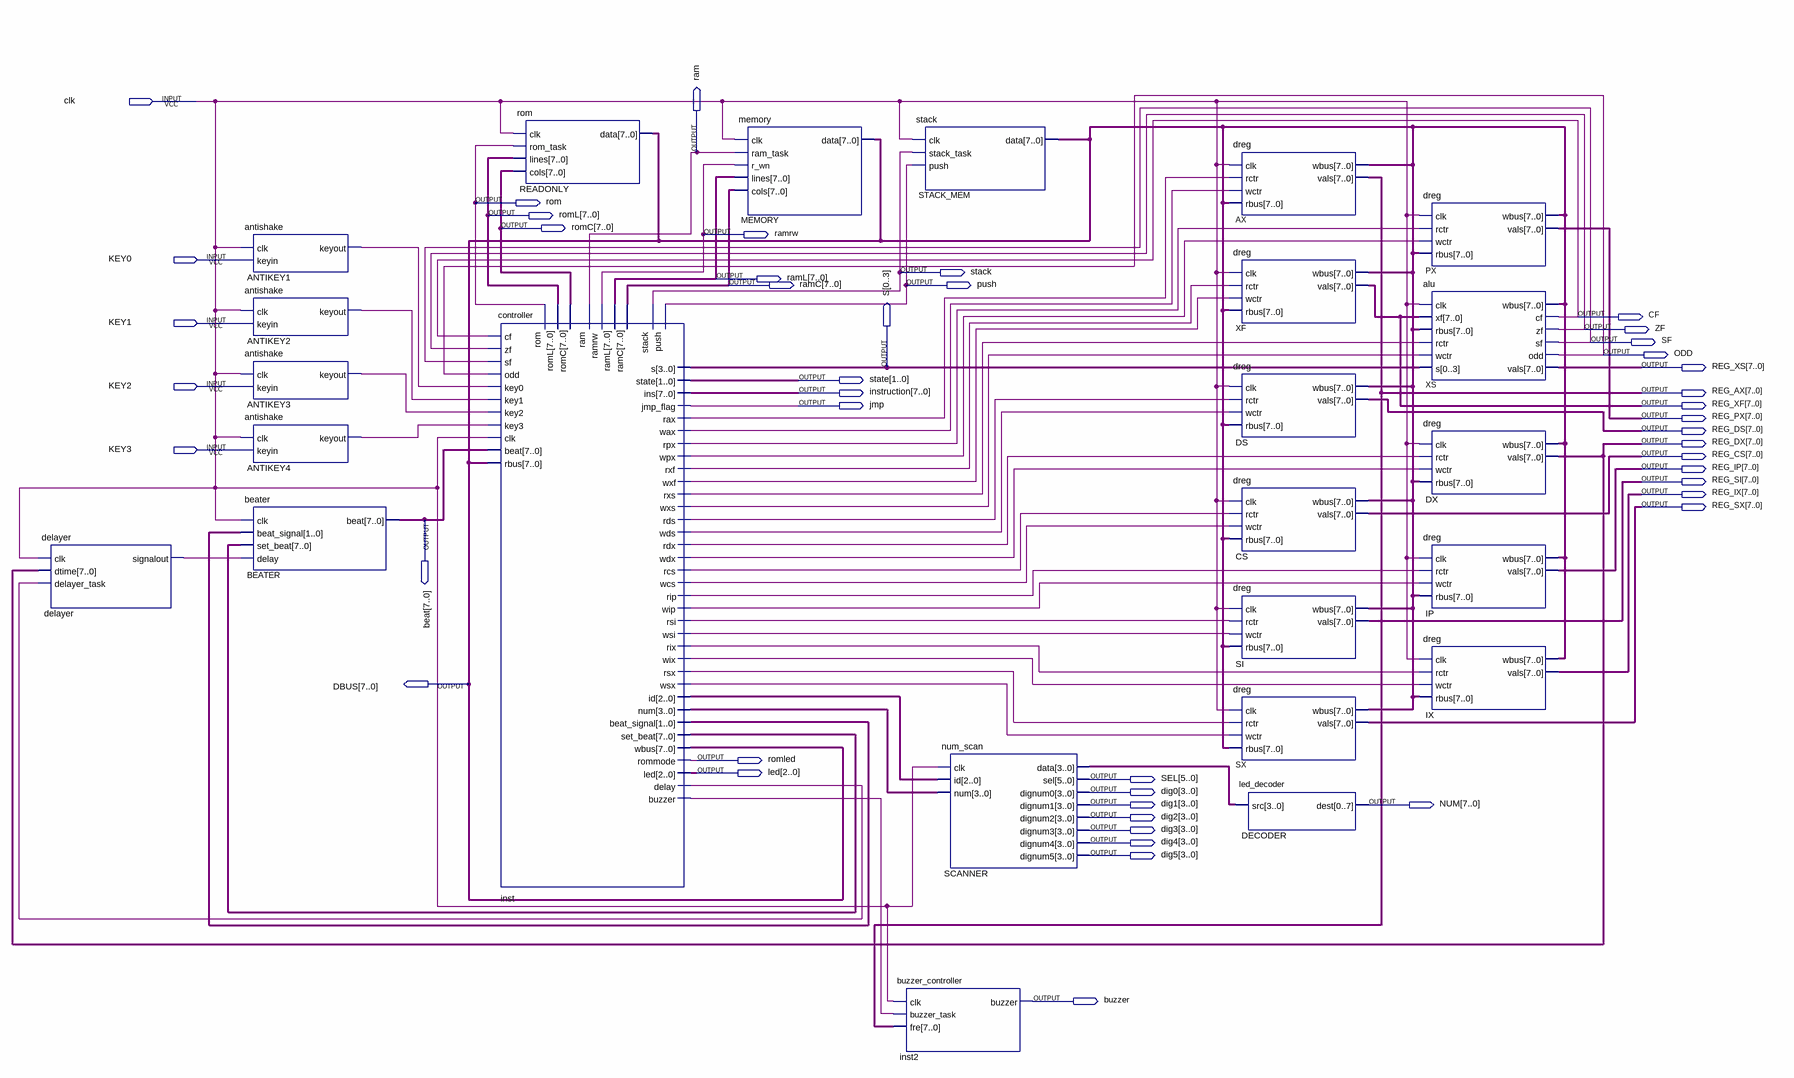
[diagram p0: schematic sheet]
// Quartus schematic model.bdf as structural Verilog: 24 symbols, 46 pins
module model (
  input  clk,
  input  KEY0,
  input  KEY1,
  input  KEY2,
  input  KEY3,
  output ram,
  output rom,
  output [7:0] romL,
  output [7:0] romC,
  output ramrw,
  output stack,
  output [7:0] ramL,
  output [7:0] ramC,
  output push,
  output CF,
  output ZF,
  output SF,
  output ODD,
  output [0:3] S,
  output [7:0] REG_XS,
  output [1:0] state,
  output [7:0] instruction,
  output [7:0] REG_AX,
  output jmp,
  output [7:0] REG_XF,
  output [7:0] REG_PX,
  output [7:0] REG_DS,
  output [7:0] REG_DX,
  output [7:0] REG_CS,
  output [7:0] REG_IP,
  output [7:0] REG_SI,
  output [7:0] REG_IX,
  output [7:0] REG_SX,
  output [7:0] beat,
  output [7:0] DBUS,
  output romled,
  output [2:0] led,
  output [5:0] SEL,
  output [3:0] dig0,
  output [3:0] dig1,
  output [7:0] NUM,
  output [3:0] dig2,
  output [3:0] dig3,
  output [3:0] dig4,
  output [3:0] dig5,
  output buzzer
);

  wire ANTIKEY1_keyout, ANTIKEY2_keyout, ANTIKEY3_keyout, ANTIKEY4_keyout, delayer_signalout, inst_buzzer,
       inst_delay, inst_rax, inst_rcs, inst_rds, inst_rdx, inst_rip, inst_rix, inst_rpx, inst_rsi, inst_rsx,
       inst_rxf, inst_rxs, inst_wax, inst_wcs, inst_wds, inst_wdx, inst_wip, inst_wix, inst_wpx, inst_wsi,
       inst_wsx, inst_wxf, inst_wxs;
  wire [1:0] inst_beat_signal;
  wire [2:0] inst_id;
  wire [3:0] inst_num, SCANNER_data;
  wire [7:0] inst_set_beat;

  delayer delayer (.clk(clk), .dtime(REG_DX), .delayer_task(inst_delay), .signalout(delayer_signalout));
  antishake ANTIKEY1 (.clk(clk), .keyin(KEY0), .keyout(ANTIKEY1_keyout));
  antishake ANTIKEY2 (.clk(clk), .keyin(KEY1), .keyout(ANTIKEY2_keyout));
  antishake ANTIKEY3 (.clk(clk), .keyin(KEY2), .keyout(ANTIKEY3_keyout));
  antishake ANTIKEY4 (.clk(clk), .keyin(KEY3), .keyout(ANTIKEY4_keyout));
  beater BEATER (
    .clk(clk), .beat_signal(inst_beat_signal), .set_beat(inst_set_beat), .delay(delayer_signalout),
    .beat(beat));
  controller inst (
    .cf(CF), .zf(ZF), .sf(SF), .odd(ODD), .key0(ANTIKEY1_keyout), .key1(ANTIKEY2_keyout),
    .key2(ANTIKEY3_keyout), .key3(ANTIKEY4_keyout), .clk(clk), .beat(beat), .rbus(DBUS), .s(S),
    .state(state), .ins(instruction), .jmp_flag(jmp), .rax(inst_rax), .wax(inst_wax), .rpx(inst_rpx),
    .wpx(inst_wpx), .rxf(inst_rxf), .wxf(inst_wxf), .rxs(inst_rxs), .wxs(inst_wxs), .rds(inst_rds),
    .wds(inst_wds), .rdx(inst_rdx), .wdx(inst_wdx), .rcs(inst_rcs), .wcs(inst_wcs), .rip(inst_rip),
    .wip(inst_wip), .rsi(inst_rsi), .wsi(inst_wsi), .rix(inst_rix), .wix(inst_wix), .rsx(inst_rsx),
    .wsx(inst_wsx), .id(inst_id), .num(inst_num), .beat_signal(inst_beat_signal), .set_beat(inst_set_beat),
    .wbus(DBUS), .rommode(romled), .led(led), .delay(inst_delay), .buzzer(inst_buzzer), .rom(rom), .ram(ram),
    .ramrw(ramrw), .stack(stack), .push(push), .ramC(ramC), .romL(romL), .romC(romC), .ramL(ramL));
  rom READONLY (.clk(clk), .rom_task(rom), .lines(romL), .cols(romC), .data(DBUS));
  memory MEMORY (.clk(clk), .ram_task(ram), .r_wn(ramrw), .lines(ramL), .cols(ramC), .data(DBUS));
  buzzer_controller inst2 (.clk(clk), .buzzer_task(inst_buzzer), .fre(REG_AX), .buzzer(buzzer));
  stack STACK_MEM (.clk(clk), .stack_task(stack), .push(push), .data(DBUS));
  num_scan SCANNER (
    .clk(clk), .id(inst_id), .num(inst_num), .data(SCANNER_data), .sel(SEL), .dignum0(dig0), .dignum1(dig1),
    .dignum2(dig2), .dignum3(dig3), .dignum4(dig4), .dignum5(dig5));
  dreg AX (.clk(clk), .rctr(inst_rax), .wctr(inst_wax), .rbus(DBUS), .wbus(DBUS), .vals(REG_AX));
  dreg XF (.clk(clk), .rctr(inst_rxf), .wctr(inst_wxf), .rbus(DBUS), .wbus(DBUS), .vals(REG_XF));
  dreg DS (.clk(clk), .rctr(inst_rds), .wctr(inst_wds), .rbus(DBUS), .wbus(DBUS), .vals(REG_DS));
  dreg CS (.clk(clk), .rctr(inst_rcs), .wctr(inst_wcs), .rbus(DBUS), .wbus(DBUS), .vals(REG_CS));
  dreg SI (.clk(clk), .rctr(inst_rsi), .wctr(inst_wsi), .rbus(DBUS), .wbus(DBUS), .vals(REG_SI));
  dreg SX (.clk(clk), .rctr(inst_rsx), .wctr(inst_wsx), .rbus(DBUS), .wbus(DBUS), .vals(REG_SX));
  led_decoder DECODER (.src(SCANNER_data), .dest(NUM));
  dreg PX (.clk(clk), .rctr(inst_rpx), .wctr(inst_wpx), .rbus(DBUS), .wbus(DBUS), .vals(REG_PX));
  alu XS (
    .clk(clk), .xf(REG_XF), .rbus(DBUS), .rctr(inst_rxs), .wctr(inst_wxs), .s(S), .wbus(DBUS), .cf(CF),
    .zf(ZF), .sf(SF), .odd(ODD), .vals(REG_XS));
  dreg DX (.clk(clk), .rctr(inst_rdx), .wctr(inst_wdx), .rbus(DBUS), .wbus(DBUS), .vals(REG_DX));
  dreg IP (.clk(clk), .rctr(inst_rip), .wctr(inst_wip), .rbus(DBUS), .wbus(DBUS), .vals(REG_IP));
  dreg IX (.clk(clk), .rctr(inst_rix), .wctr(inst_wix), .rbus(DBUS), .wbus(DBUS), .vals(REG_IX));
endmodule
